# Altium schematic sheet SH25 - ENET- POWER.SchDoc
size 386 x 246 mm
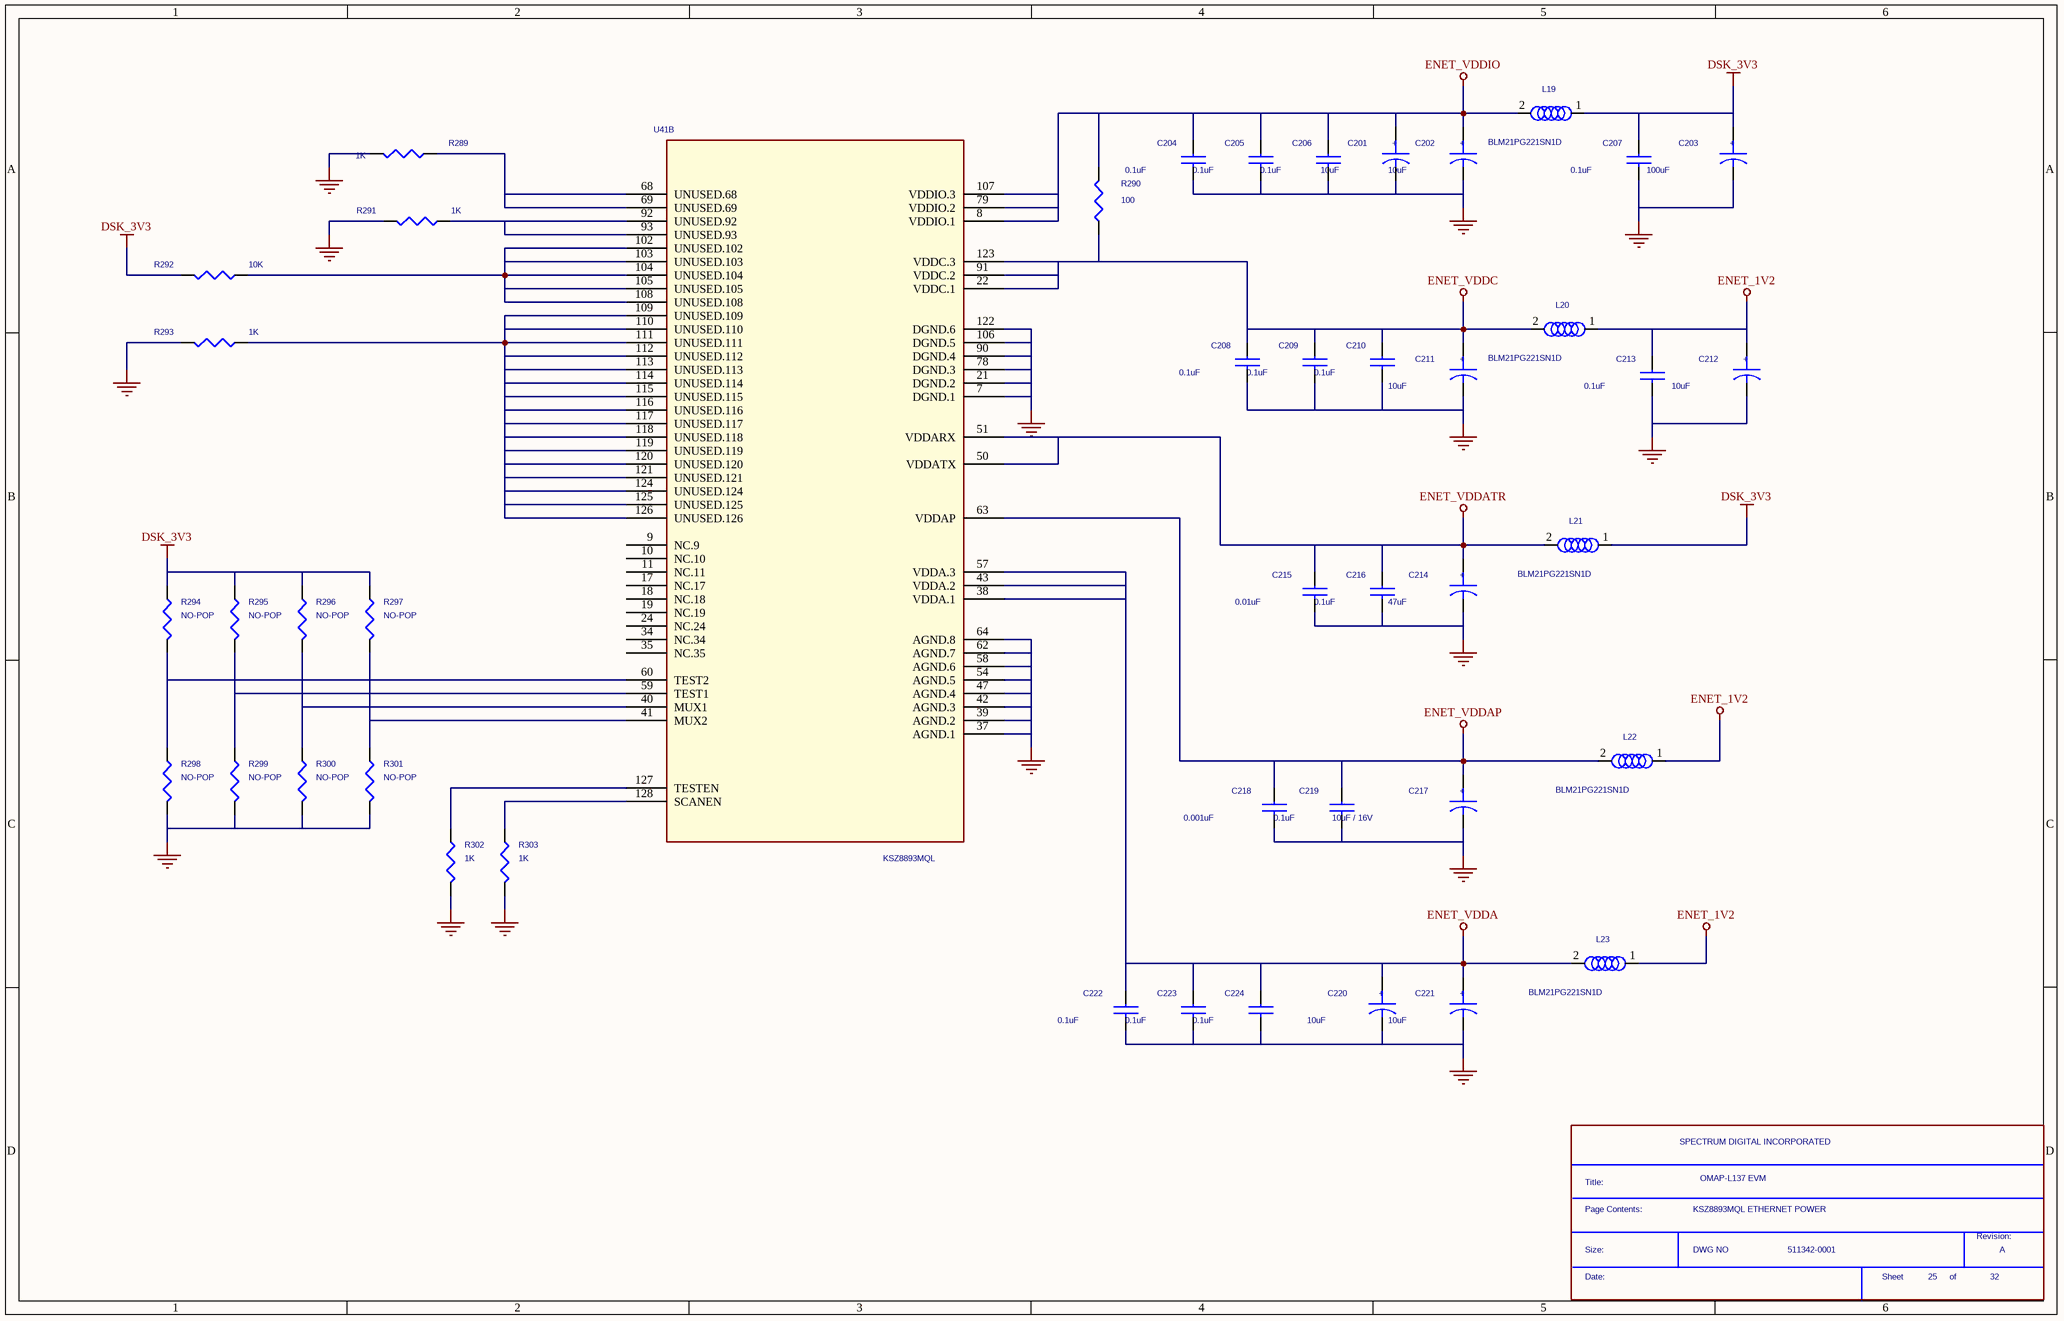
[diagram p0: SH25 - ENET- POWER.SchDoc]

## Parts
*  Page Contents:: KSZ8893MQL ETHERNET POWER  RevCode: A  Title: OMAP-L137 EVM  OrgName: SPECTRUM DIGITAL INCORPORATED  Doc: 511342-0001  Page Number: 25  Page Count: 32  (hidden comment: SDTitleBlock)  (graphical)
C201  10uF  [c1206-40x70-POL]
C202  10uF  [c1206-40x70-POL]
C203  100uF  [c7343-84x118]
C204  0.1uF  [c402-25]
C205  0.1uF  [c402-25]
C206  0.1uF  [c402-25]
C207  0.1uF  [c402-25]
C208  0.1uF  [c402-25]
C209  0.1uF  [c402-25]
C210  0.1uF  [c402-25]
C211  10uF  [c1206-40x70-POL]
C212  10uF  [c1206-40x70-POL]
C213  0.1uF  [c402-25]
C214  47uF  [c7343-84x118]
C215  0.01uF  [c402-25]
C216  0.1uF  [c402-25]
C217  10uF / 16V  [c1206-40x70-POL]
C218  0.001uF  [c402-25]
C219  0.1uF  [c402-25]
C220  10uF  [c1206-40x70-POL]
C221  10uF  [c1206-40x70-POL]
C222  0.1uF  [c402-25]
C223  0.1uF  [c402-25]
C224  0.1uF  [c402-25]
L19  BLM21PG221SN1D  [l805-35x60]
L20  BLM21PG221SN1D  [l805-35x60]
L21  BLM21PG221SN1D  [l805-35x60]
L22  BLM21PG221SN1D  [l805-35x60]
L23  BLM21PG221SN1D  [l805-35x60]
R289  1K  [r402-25]
R290  100  [r603-35x45]
R291  1K  [r402-25]
R292  10K  [r402-25]
R293  1K  [r402-25]
R294  NO-POP  [r402-25]
R295  NO-POP  [r402-25]
R296  NO-POP  [r402-25]
R297  NO-POP  [r402-25]
R298  NO-POP  [r402-25]
R299  NO-POP  [r402-25]
R300  NO-POP  [r402-25]
R301  NO-POP  [r402-25]
R302  1K  [r402-25]
R303  1K  [r402-25]
U41  KSZ8893MQL  [pqfp128rec-12x70]  (part B of 2)

## Nets
DSK_3V3: C203.1 C207.1 L19.1 L21.1 R292.2 R294.1 R295.1 R296.1 R297.1
ENET_1V2: C212.1 C213.1 L20.1 L22.1 L23.1
ENET_VDDA: C220.1 C221.1 C222.1 C223.1 C224.1 L23.2 U41.38(VDDA.1) U41.43(VDDA.2) U41.57(VDDA.3)
ENET_VDDAP: C217.1 C218.1 C219.1 L22.2 U41.63(VDDAP)
ENET_VDDATR: C214.1 C215.1 C216.1 L21.2 U41.50(VDDATX) U41.51(VDDARX)
ENET_VDDC: C208.1 C209.1 C210.1 C211.1 L20.2 R290.1 U41.22(VDDC.1) U41.91(VDDC.2) U41.123(VDDC.3)
ENET_VDDIO: C201.1 C202.1 C204.1 C205.1 C206.1 L19.2 R290.2 U41.8(VDDIO.1) U41.79(VDDIO.2) U41.107(VDDIO.3)
GND: C201.2 C202.2 C203.2 C204.2 C205.2 C206.2 C207.2 C208.2 C209.2 C210.2 C211.2 C212.2 C213.2 C214.2 C215.2 C216.2 C217.2 C218.2 C219.2 C220.2 C221.2 C222.2 C223.2 C224.2 R289.1 R291.2 R293.2 R298.2 R299.2 R300.2 R301.2 R302.2 R303.2 U41.7(DGND.1) U41.21(DGND.2) U41.37(AGND.1) U41.39(AGND.2) U41.42(AGND.3) U41.47(AGND.4) U41.54(AGND.5) U41.58(AGND.6) U41.62(AGND.7) U41.64(AGND.8) U41.78(DGND.3) U41.90(DGND.4) U41.106(DGND.5) U41.122(DGND.6)
NetR289_2: R289.2 U41.68(UNUSED.68) U41.69(UNUSED.69)
NetR291_1: R291.1 U41.92(UNUSED.92) U41.93(UNUSED.93)
NetR292_1: R292.1 U41.102(UNUSED.102) U41.103(UNUSED.103) U41.104(UNUSED.104) U41.105(UNUSED.105) U41.108(UNUSED.108)
NetR293_1: R293.1 U41.109(UNUSED.109) U41.110(UNUSED.110) U41.111(UNUSED.111) U41.112(UNUSED.112) U41.113(UNUSED.113) U41.114(UNUSED.114) U41.115(UNUSED.115) U41.116(UNUSED.116) U41.117(UNUSED.117) U41.118(UNUSED.118) U41.119(UNUSED.119) U41.120(UNUSED.120) U41.121(UNUSED.121) U41.124(UNUSED.124) U41.125(UNUSED.125) U41.126(UNUSED.126)
NetR294_2: R294.2 R298.1 U41.60(TEST2)
NetR295_2: R295.2 R299.1 U41.59(TEST1)
NetR296_2: R296.2 R300.1 U41.40(MUX1)
NetR297_2: R297.2 R301.1 U41.41(MUX2)
NetR302_1: R302.1 U41.127(TESTEN)
NetR303_1: R303.1 U41.128(SCANEN)

Not connected (* = marked no-connect by the designer): U41 9(NC.9) 10(NC.10) 11(NC.11) 17(NC.17) 18(NC.18) 19(NC.19) 24(NC.24) 34(NC.34) 35(NC.35)

## Notes on the sheet
- (in symbol CAPACITOR POL_0) +
- (in symbol SDTitleBlock) Title:; Page Contents:; Revision:; Size:; DWG NO; Date:; Sheet; of

## Library data of the parts
C201 C202 C211 C212 C217 C220 C221 = CAPACITOR POL_0: Part #: 101003-0101R
C203 = CAPACITOR POL_0: Part #: 101608-0102R
C204-C210 C213 C216 C219 C222-C224 = CAP NP: Part #: 101587-1100R
C214 = CAPACITOR POL_0: Part #: 100995-0471R
C215 = CAP NP: Part #: 101587-1101R
C218 = CAP NP: Part #: 102058-1102R
L19-L23 = FBEAD_1: Part Number: IND-FBD-01; Part #: 101228-2201R; Part Type: Inductor
R289 R291 R293 R302 R303 = RESISTOR_0: Part #: 101370-1002R
R290 = R: Part #: 100642-1001R
R292 = RESISTOR_0: Part #: 101370-1003R
R294-R301 = RESISTOR_0: Part #: R0402-NOPOP
U41 = KS8995_multi_0: Part #: 102795-0001R